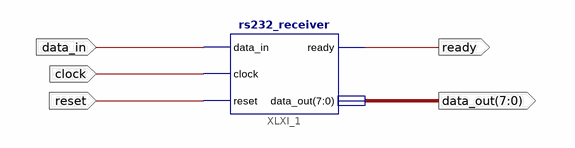
[diagram p0: schematic sheet 1]
// Xilinx ISE schematic rs232_receiver_implementacja.sch (spartan3e) as structural Verilog: 1 symbols, 5 ports
module rs232_receiver_implementacja (
  input  data_in,
  input  clock,
  input  reset,
  output ready,
  output [7:0] data_out
);

  rs232_receiver XLXI_1 (.data_in(data_in), .clock(clock), .reset(reset), .ready(ready), .data_out(data_out));
endmodule
